# Altium schematic sheet MB_SCH.SchDoc
size A3
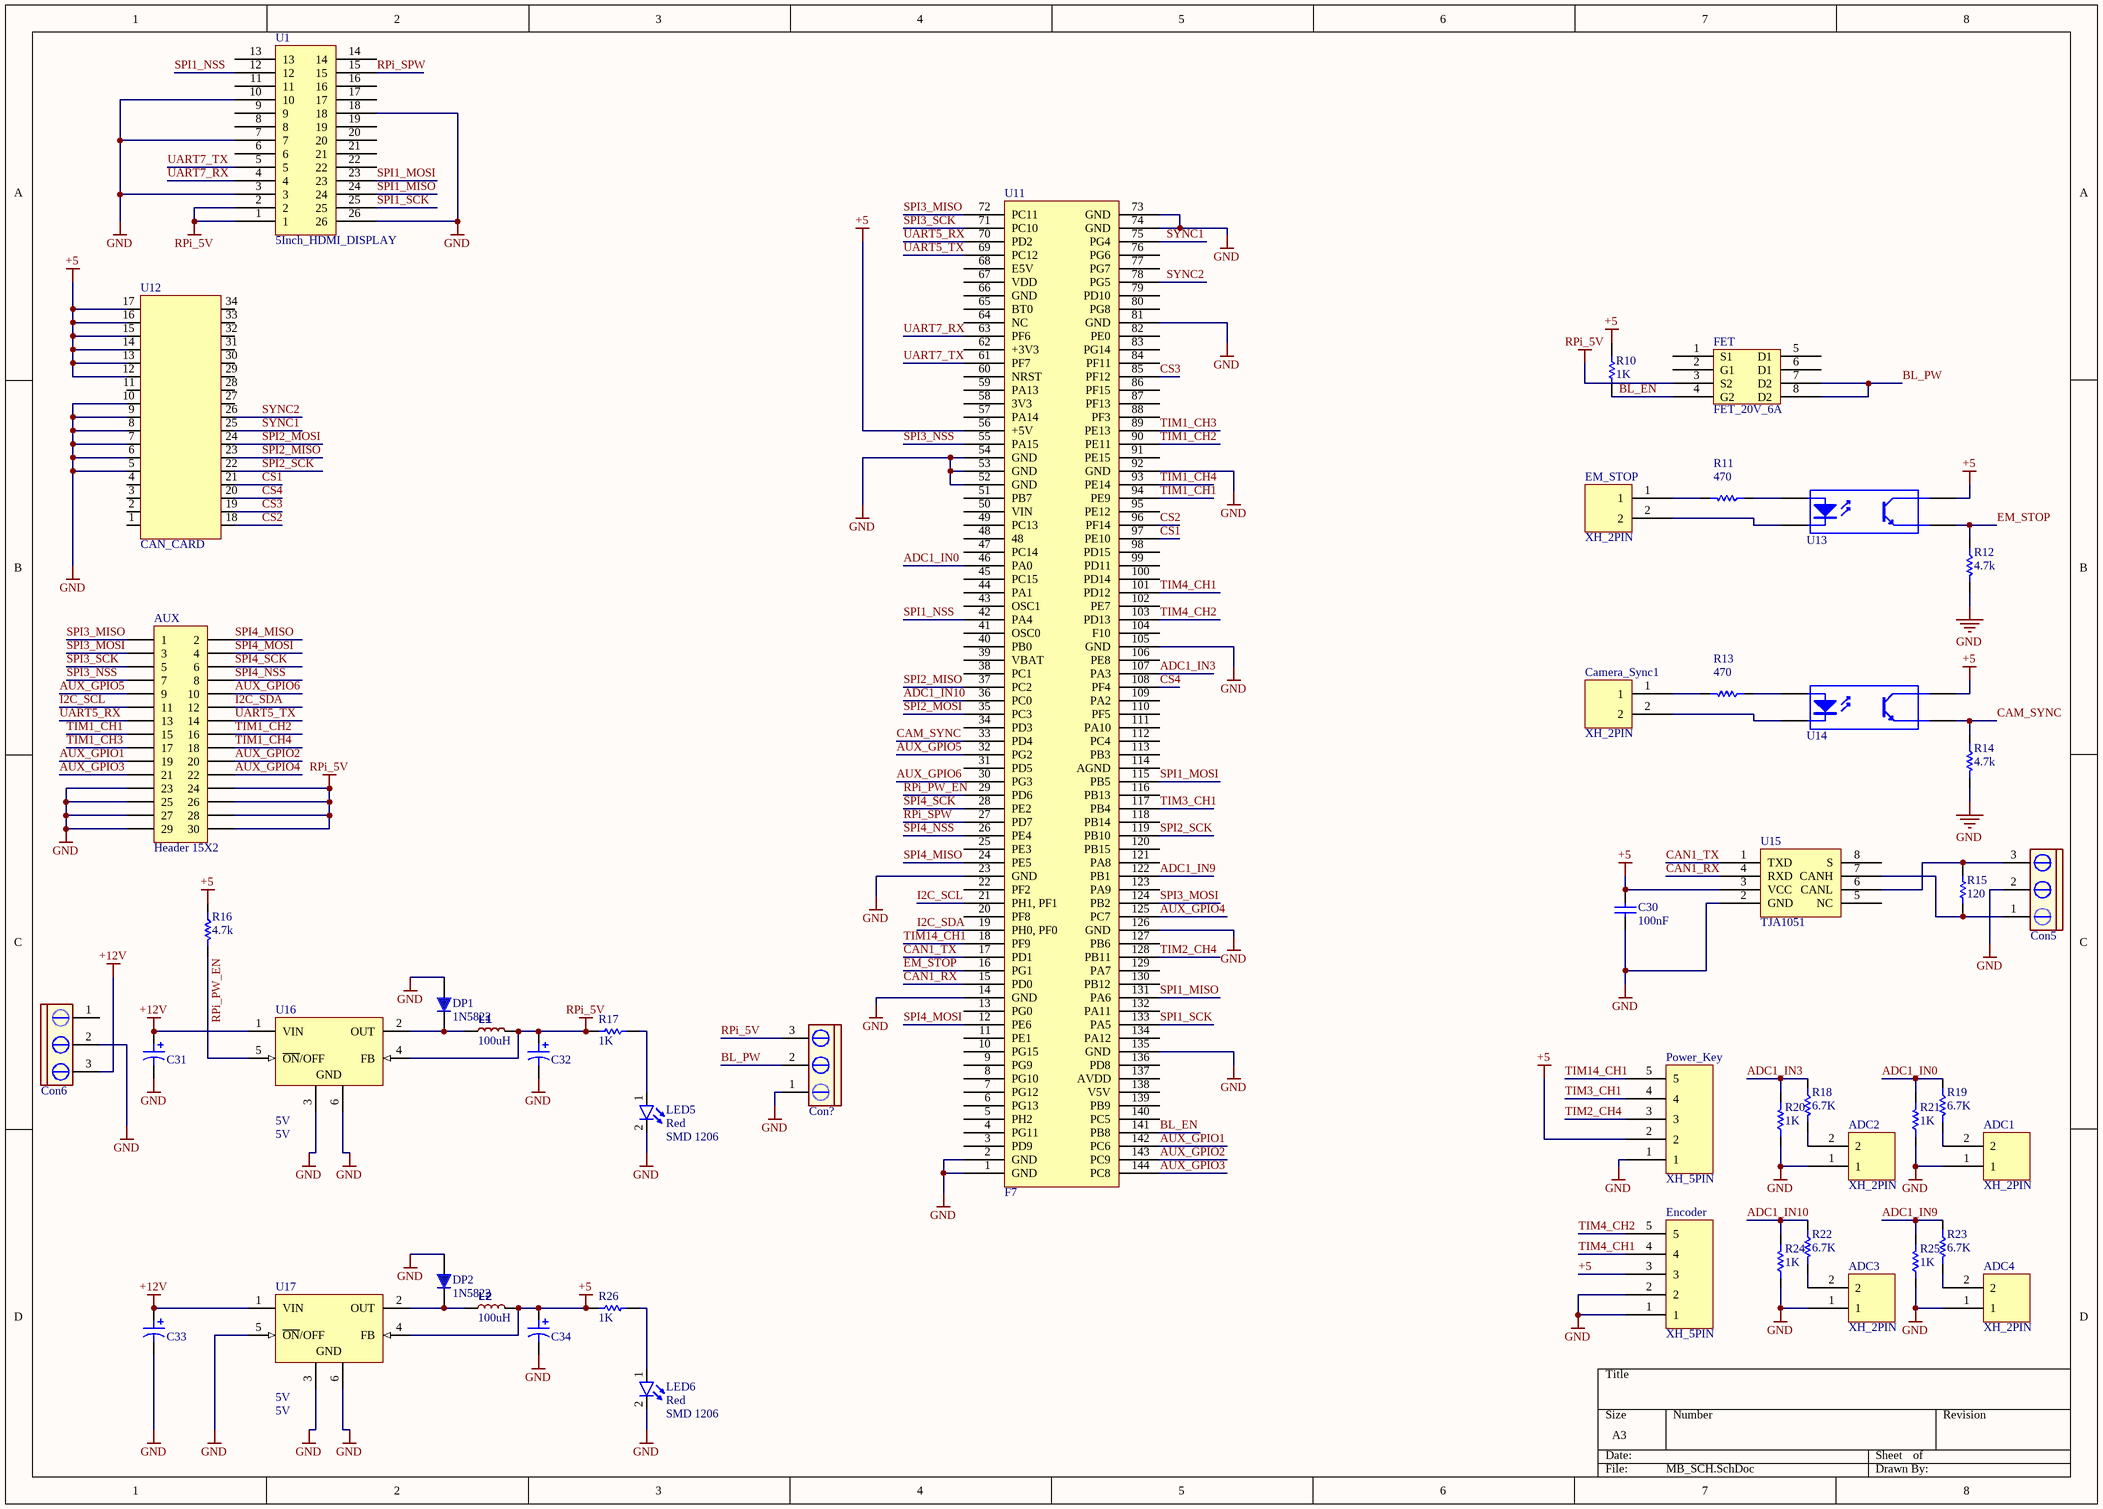
[diagram p0: MB_SCH.SchDoc]

## Parts
ADC1  XH_2PIN  [XH_2PIN]
ADC2  XH_2PIN  [XH_2PIN]
ADC3  XH_2PIN  [XH_2PIN]
ADC4  XH_2PIN  [XH_2PIN]
AUX  Header 15X2  [HDR2X15]
C30  100nF  [CAPC3413X12N]
C31  100uF50V  [Cap electrolitic radial 6x7-2.5]  (value not drawn)
C32  1000uF50V  [Cap electrolitic radial 6x7-2.5]  (value not drawn)
C33  100uF50V  [Cap electrolitic radial 6x7-2.5]  (value not drawn)
C34  1000uF50V  [Cap electrolitic radial 6x7-2.5]  (value not drawn)
Camera_Sync1  XH_2PIN  [XH_2PIN]
Con5  CON3 pin Green  [My_CN3]  (value not drawn)
Con6  CON3 pin Green  [My_CN3]  (value not drawn)
Con?  CON3 pin Green  [My_CN3]  (value not drawn)
DP1  1N5822  [430X270D]
DP2  1N5822  [430X270D]
EM_STOP  XH_2PIN  [XH_2PIN]
Encoder  XH_5PIN  [XH_5PIN]
FET  FET_20V_6A  [FET_20V_6A]
L1  value 100uH  [_INDUCTOR-SMD-13.0mm]  (hidden comment: Inductor)
L2  value 100uH  [_INDUCTOR-SMD-13.0mm]  (hidden comment: Inductor)
LED5  Size: SMD 1206  [LED SMD 1206]  (hidden comment: Red)
LED6  Size: SMD 1206  [LED SMD 1206]  (hidden comment: Red)
Power_Key  XH_5PIN  [XH_5PIN]
R10  1K  [RESC3413X04N]
R11  470  [RES 0805 (2012X06L)]
R12  4.7k  [RES 0805 (2012X06L)]
R13  470  [RES 0805 (2012X06L)]
R14  4.7k  [RES 0805 (2012X06L)]
R15  120  [RESC3413X04N]
R16  4.7k  [RES 0805 (2012X06L)]
R17  1K  [RESC3413X04N]
R18  6.7K  [RES 0805 (2012X06L)]
R19  6.7K  [RES 0805 (2012X06L)]
R20  1K  [RES 0805 (2012X06L)]
R21  1K  [RES 0805 (2012X06L)]
R22  6.7K  [RES 0805 (2012X06L)]
R23  6.7K  [RES 0805 (2012X06L)]
R24  1K  [RES 0805 (2012X06L)]
R25  1K  [RES 0805 (2012X06L)]
R26  1K  [RESC3413X04N]
U1  5Inch_HDMI_DISPLAY  [5Inch_HDMI_DISPLAY]
U11  F7  [F7]
U12  CAN_CARD  [CAN_CARD]
U13  Optoisolator  [My_opto]  (value not drawn)
U14  Optoisolator  [My_opto]  (value not drawn)
U15  TJA1051  [SO-8N]
U16  5V  [_TO263]
U17  5V  [_TO263]

## Nets
+5: C30.2 C34.1 Encoder.3 L2.2 Power_Key.2 R10.1 R16.1 R26.2 U11.56(+5V) U12.12 U12.13 U12.14 U12.15 U12.16 U12.17 U13.3(C) U14.3(C) U15.3(VCC) U17.4(FB)
+12V: C31.1 C33.1 Con6.3 U16.1(VIN) U17.1(VIN)
GND: ADC1.1 ADC2.1 ADC3.1 ADC4.1 AUX.23 AUX.25 AUX.27 AUX.29 C30.1 C31.2 C32.2 C33.2 C34.2 Con5.2 Con6.2 Con?.1 DP1.1 DP2.1 Encoder.1 Encoder.2 LED5.2(K) LED6.2(K) Power_Key.1 R12.2 R14.2 R20.1 R21.1 R24.1 R25.1 U1.3 U1.7 U1.10 U1.18 U1.26 U11.1(GND) U11.2(GND) U11.14(GND) U11.23(GND) U11.52(GND) U11.53(GND) U11.54(GND) U11.73(GND) U11.74(GND) U11.81(GND) U11.92(GND) U11.105(GND) U11.126(GND) U11.135(GND) U12.5 U12.6 U12.7 U12.8 U12.9 U12.10 U15.2(GND) U16.3(GND) U16.6(GND) U17.3(GND) U17.5(~{ON}/OFF) U17.6(GND)
RPi_5V: AUX.24 AUX.26 AUX.28 AUX.30 C32.1 Con?.3 FET.3(S2) L1.2 R17.2 U1.1 U1.2 U16.4(FB)
ADC1_IN0: R19.1 R21.2 U11.46(PA0)
ADC1_IN3: R18.1 R20.2 U11.107(PA3)
ADC1_IN9: R23.1 R25.2 U11.122(PB1)
ADC1_IN10: R22.1 R24.2 U11.36(PC0)
AUX_GPIO1: AUX.19 U11.142(PC6)
AUX_GPIO2: AUX.20 U11.143(PC9)
AUX_GPIO3: AUX.21 U11.144(PC8)
AUX_GPIO4: AUX.22 U11.125(PC7)
AUX_GPIO5: AUX.9 U11.32(PG2)
AUX_GPIO6: AUX.10 U11.30(PG3)
BL_EN: FET.4(G2) R10.2 U11.141(PB8)
BL_PW: Con?.2 FET.7(D2) FET.8(D2)
CAM_SYNC: R14.1 U11.33(PD4) U14.4(E)
CAN1_RX: U11.15(PD0) U15.4(RXD)
CAN1_TX: U11.17(PD1) U15.1(TXD)
CS1: U11.97(PE10) U12.21
CS2: U11.96(PF14) U12.18
CS3: U11.85(PF12) U12.19
CS4: U11.108(PF4) U12.20
EM_STOP: R12.1 U11.16(PG1) U13.4(E)
I2C_SCL: AUX.11 U11.21(PH1,_PF1)
I2C_SDA: AUX.12 U11.19(PH0,_PF0)
RPi_PW_EN: R16.2 U11.29(PD6) U16.5(~{ON}/OFF)
RPi_SPW: U1.15 U11.27(PD7)
SPI1_MISO: U1.24 U11.131(PA6)
SPI1_MOSI: U1.23 U11.115(PB5)
SPI1_NSS: U1.12 U11.42(PA4)
SPI1_SCK: U1.25 U11.133(PA5)
SPI2_MISO: U11.37(PC2) U12.23
SPI2_MOSI: U11.35(PC3) U12.24
SPI2_SCK: U11.119(PB10) U12.22
SPI3_MISO: AUX.1 U11.72(PC11)
SPI3_MOSI: AUX.3 U11.124(PB2)
SPI3_NSS: AUX.7 U11.55(PA15)
SPI3_SCK: AUX.5 U11.71(PC10)
SPI4_MISO: AUX.2 U11.24(PE5)
SPI4_MOSI: AUX.4 U11.12(PE6)
SPI4_NSS: AUX.8 U11.26(PE4)
SPI4_SCK: AUX.6 U11.28(PE2)
SYNC1: U11.75(PG4) U12.25
SYNC2: U11.78(PG5) U12.26
TIM1_CH1: AUX.15 U11.94(PE9)
TIM1_CH2: AUX.16 U11.90(PE11)
TIM1_CH3: AUX.17 U11.89(PE13)
TIM1_CH4: AUX.18 U11.93(PE14)
TIM2_CH4: Power_Key.3 U11.128(PB11)
TIM3_CH1: Power_Key.4 U11.117(PB4)
TIM4_CH1: Encoder.4 U11.101(PD12)
TIM4_CH2: Encoder.5 U11.103(PD13)
TIM14_CH1: Power_Key.5 U11.18(PF9)
UART5_RX: AUX.13 U11.70(PD2)
UART5_TX: AUX.14 U11.69(PC12)
UART7_RX: U1.4 U11.63(PF6)
UART7_TX: U1.5 U11.61(PF7)
NetADC1_2: ADC1.2 R19.2
NetADC2_2: ADC2.2 R18.2
NetADC3_2: ADC3.2 R22.2
NetADC4_2: ADC4.2 R23.2
NetCamera_Sync1_1: Camera_Sync1.1 R13.2
NetCamera_Sync1_2: Camera_Sync1.2 U14.2(K)
NetCon5_1: Con5.1 R15.2 U15.7(CANH)
NetCon5_3: Con5.3 R15.1 U15.6(CANL)
NetDP1_2: DP1.2 L1.1 U16.2(OUT)
NetDP2_2: DP2.2 L2.1 U17.2(OUT)
NetEM_STOP_1: EM_STOP.1 R11.2
NetEM_STOP_2: EM_STOP.2 U13.2(K)
NetLED5_1: LED5.1(A) R17.1
NetLED6_1: LED6.1(A) R26.1
NetR11_1: R11.1 U13.1(A)
NetR13_1: R13.1 U14.1(A)

Not connected (* = marked no-connect by the designer): Con6 1; FET 1(S1) 2(G1) 5(D1) 6(D1); U1 6 8 9 11 13 14 16 17 19 20 21 22; U11 3(PD9) 4(PG11) 5(PH2) 6(PG13) 7(PG12) 8(PG10) 9(PG9) 10(PG15) 11(PE1) 13(PG0) 20(PF8) 22(PF2) 25(PE3) 31(PD5) 34(PD3) 38(PC1) 39(VBAT) 40(PB0) 41(OSC0) 43(OSC1) 44(PA1) 45(PC15) 47(PC14) 48 49(PC13) 50(VIN) 51(PB7) 57(PA14) 58(3V3) 59(PA13) 60(NRST) 62(+3V3) 64(NC) 65(BT0) 66(GND) 67(VDD) 68(E5V) 76(PG6) 77(PG7) 79(PD10) 80(PG8) 82(PE0) 83(PG14) 84(PF11) 86(PF15) 87(PF13) 88(PF3) 91(PE15) 95(PE12) 98(PD15) 99(PD11) 100(PD14) 102(PE7) 104(F10) 106(PE8) 109(PA2) 110(PF5) 111(PA10) 112(PC4) 113(PB3) 114(AGND) 116(PB13) 118(PB14) 120(PB15) 121(PA8) 123(PA9) 127(PB6) 129(PA7) 130(PB12) 132(PA11) 134(PA12) 136(PD8) 137(AVDD) 138(V5V) 139(PB9) 140(PC5); U12 1 2 3 4 11 27 28 29 30 31 32 33 34; U15 5(NC) 8(S)

## Library data of the parts
AUX = Header 15X2: Header, 15-Pin, Dual row; LatestRevisionDate: 17-Jul-2002; LatestRevisionNote: Re-released for DXP Platform.; Publisher: Altium Limited
C30 = CAP SMD 0805: CAP 0805; Designer: Abbas Basereh; Desc.: CAP SMD 0805; Data: 16-12-2016
C31-C34 = Cap ELECTROLITIC TOTAL SIZE: Cap electrolitic radial; Designer: Abbas Basereh; Data: 16-12-2016; Part. No: *
  C31 C33: VALUE: 100uF50V
  C32 C34: VALUE: 1000uF50V
Con5 Con6 Con? = CON3 pin Green: Connector green screw
DP1 DP2 = 1N5819: Schottkey Rectifiers; Designer: Abbas Basereh; Data: 16-12-2016; Link: *; Part. No: *
LED5 LED6 = LED: Designer: Saeid Jorablo; Organazation: ControTec; Adding Date: 1387/12/22; Color: Red
R10 R15 R17 R26 = RES 0805 0.125W: RES 0805; Designer: Abbas Basereh; Desc.: RES SMD 0805; Data: 16-12-2016
R11-R14 R16 R18-R25 = Resistor
  R11 R13: Value: 470
  R12 R14 R16: Value: 4.7k
  R18 R19 R22 R23: Value: 6.7K
  R20 R21 R24 R25: Value: 1K
U16 U17 = LM2576: Buck Step Down Regulator with 4.75 to 60 V Input and 15 V Output, -40 to 125 degC, 5-Pin DDPAK/TO-263 (KTT), Green (RoHS & no Sb/Br); Value: 5V